# Altium schematic sheet FPGA_MODULE.SchDoc
size A4; SheetNumber: 5; SheetTotal: 8
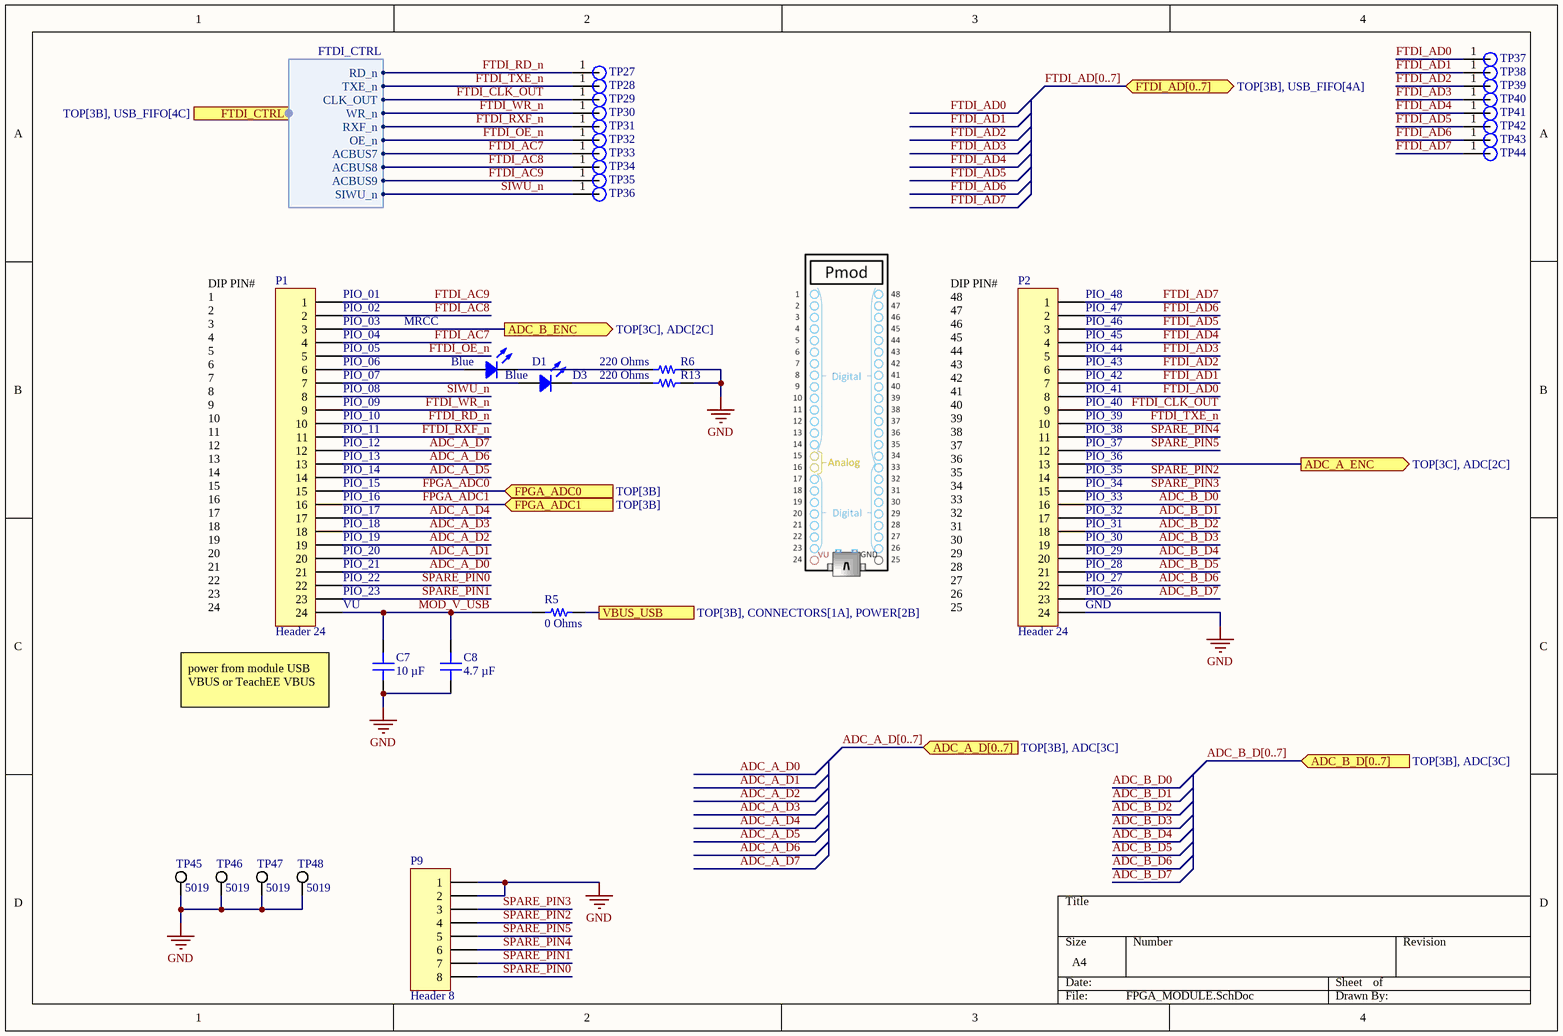
[diagram p0: FPGA_MODULE.SchDoc]

## Parts
C7  10 µF  [CAP 0805_2012]
C8  4.7 µF  [CAP 0402_1005]
D1  Blue  [LED 1206_3216 BLUE]
D3  Blue  [LED 1206_3216 BLUE]
P1  Header 24  [HDR1X24]
P2  Header 24  [HDR1X24]
P9  Header 8  [HDR1X8]
R5  0 Ohms  [RES 1206_3216]
R6  220 Ohms  [RES 0402_1005]
R13  220 Ohms  [RES 0402_1005]
TP27  Test Point  [TP1]  (value not drawn)  (no BOM)
TP28  Test Point  [TP1]  (value not drawn)  (no BOM)
TP29  Test Point  [TP1]  (value not drawn)  (no BOM)
TP30  Test Point  [TP1]  (value not drawn)  (no BOM)
TP31  Test Point  [TP1]  (value not drawn)  (no BOM)
TP32  Test Point  [TP1]  (value not drawn)  (no BOM)
TP33  Test Point  [TP1]  (value not drawn)  (no BOM)
TP34  Test Point  [TP1]  (value not drawn)  (no BOM)
TP35  Test Point  [TP1]  (value not drawn)  (no BOM)
TP36  Test Point  [TP1]  (value not drawn)  (no BOM)
TP37  Test Point  [TP1]  (value not drawn)  (no BOM)
TP38  Test Point  [TP1]  (value not drawn)  (no BOM)
TP39  Test Point  [TP1]  (value not drawn)  (no BOM)
TP40  Test Point  [TP1]  (value not drawn)  (no BOM)
TP41  Test Point  [TP1]  (value not drawn)  (no BOM)
TP42  Test Point  [TP1]  (value not drawn)  (no BOM)
TP43  Test Point  [TP1]  (value not drawn)  (no BOM)
TP44  Test Point  [TP1]  (value not drawn)  (no BOM)
TP45  5019  [KSTN-5019_V]
TP46  5019  [KSTN-5019_V]
TP47  5019  [KSTN-5019_V]
TP48  5019  [KSTN-5019_V]

## Ports
ADC_A_D[0..7] (in, see TOP[3B], ADC[3C]), ADC_A_ENC (out, see TOP[3C], ADC[2C]), ADC_B_D[0..7] (in, see TOP[3B], ADC[3C]), ADC_B_ENC (out, see TOP[3C], ADC[2C]), FPGA_ADC0 (in, see TOP[3B]), FPGA_ADC1 (in, see TOP[3B]), FTDI_AD[0..7] (bidir, see TOP[3B], USB_FIFO[4A]), FTDI_CTRL (harness FTDI_CTRL, see TOP[3B], USB_FIFO[4C]), VBUS_USB (see TOP[3B], CONNECTORS[1A], POWER[2B])

## Harnesses
FTDI_CTRL: RXF_n, TXE_n, RD_n, WR_n, CLK_OUT, OE_n, ACBUS7, ACBUS8, ACBUS9, SIWU_n

## Nets
GND: C7.1 C8.1 P2.24 P9.1 P9.2 R6.1 R13.1 TP45.1 TP46.1 TP47.1 TP48.1
ADC_A_D0: P1.21
ADC_A_D1: P1.20
ADC_A_D2: P1.19
ADC_A_D3: P1.18
ADC_A_D4: P1.17
ADC_A_D5: P1.14
ADC_A_D6: P1.13
ADC_A_D7: P1.12
ADC_A_ENC: P2.13 ; port ADC_A_ENC
ADC_B_D0: P2.16
ADC_B_D1: P2.17
ADC_B_D2: P2.18
ADC_B_D3: P2.19
ADC_B_D4: P2.20
ADC_B_D5: P2.21
ADC_B_D6: P2.22
ADC_B_D7: P2.23
ADC_B_ENC: P1.3 ; port ADC_B_ENC
FPGA_ADC0: P1.15 ; port FPGA_ADC0
FPGA_ADC1: P1.16 ; port FPGA_ADC1
FTDI_AC7: P1.4 TP33.1 ; port FTDI_CTRL.ACBUS7
FTDI_AC8: P1.2 TP34.1 ; port FTDI_CTRL.ACBUS8
FTDI_AC9: P1.1 TP35.1 ; port FTDI_CTRL.ACBUS9
FTDI_AD0: P2.8 TP37.1
FTDI_AD1: P2.7 TP38.1
FTDI_AD2: P2.6 TP39.1
FTDI_AD3: P2.5 TP40.1
FTDI_AD4: P2.4 TP41.1
FTDI_AD5: P2.3 TP42.1
FTDI_AD6: P2.2 TP43.1
FTDI_AD7: P2.1 TP44.1
FTDI_CLK_OUT: P2.9 TP29.1 ; port FTDI_CTRL.CLK_OUT
FTDI_OE_n: P1.5 TP32.1 ; port FTDI_CTRL.OE_n
FTDI_RD_n: P1.10 TP27.1 ; port FTDI_CTRL.RD_n
FTDI_RXF_n: P1.11 TP31.1 ; port FTDI_CTRL.RXF_n
FTDI_TXE_n: P2.10 TP28.1 ; port FTDI_CTRL.TXE_n
FTDI_WR_n: P1.9 TP30.1 ; port FTDI_CTRL.WR_n
MOD_V_USB: C7.2 C8.2 P1.24 R5.2
SIWU_n: P1.8 TP36.1 ; port FTDI_CTRL.SIWU_n
SPARE_PIN0: P1.22 P9.8
SPARE_PIN1: P1.23 P9.7
SPARE_PIN2: P2.14 P9.4
SPARE_PIN3: P2.15 P9.3
SPARE_PIN4: P2.11 P9.6
SPARE_PIN5: P2.12 P9.5
VBUS_USB: R5.1 ; port VBUS_USB
NetD1_1: D1.1 P1.6
NetD1_2: D1.2 R6.2
NetD3_1: D3.1 P1.7
NetD3_2: D3.2 R13.2

## Buses and harness runs
bus ADC_A_D[0..7] = port ADC_A_D[0..7]
bus ADC_B_D[0..7] = port ADC_B_D[0..7]
bus FTDI_AD[0..7] = port FTDI_AD[0..7]

## Notes on the sheet
- (near P1) PIO_01
- (near P1) PIO_02
- (near P2) PIO_47
- (near P2) PIO_48
- (near P1) PIO_03        MRCC
- (near P1) PIO_04
- (near P1) PIO_05
- (near P1) PIO_06
- (near P1) PIO_07
- (near P2) PIO_42
- (near P2) PIO_43
- (near P2) PIO_44
- (near P2) PIO_45
- (near P2) PIO_46
- (near P1) PIO_08
- (near P1) PIO_09
- (near P1) PIO_10
- (near P1) PIO_11
- (near P1) PIO_12
- (near P2) PIO_37
- (near P2) PIO_38
- (near P2) PIO_39
- (near P2) PIO_40
- (near P2) PIO_41
- (near P1) PIO_13
- (near P1) PIO_14
- (near P1) PIO_15
- (near P1) PIO_16
- (near P1) PIO_17
- (near P2) PIO_32
- (near P2) PIO_33
- (near P2) PIO_34
- (near P2) PIO_35
- (near P2) PIO_36
- (near P1) PIO_18
- (near P1) PIO_19
- (near P1) PIO_20
- (near P1) PIO_21
- (near P1) PIO_22
- (near P2) PIO_27
- (near P2) PIO_28
- (near P2) PIO_29
- (near P2) PIO_30
- (near P2) PIO_31
- DIP PIN#
  1
  2
  3
  4
  5
  6
  7
  8
  9
  10
  11
  12
  13
  14
  15
  16
  17
  18
  19
  20
  21
  22
  23
  24
- (near P1) PIO_23
- (near P1) VU
- DIP PIN#
  48
  47
  46
  45
  44
  43
  42
  41
  40
  39
  38
  37
  36
  35
  34
  33
  32
  31
  30
  29
  28
  27
  26
  25
- (near P2) PIO_26
- (near P2) GND
- power from module USB VBUS or TeachEE VBUS

## Library data of the parts
C7 = GRM21BC8YA106KE11L: CAP CER 10UF 35V X6S 0805; manufacturer: Murata Electronics; Tolerance: ±10%; Part Number: GRM21BC8YA106KE11L; Value: 10 µF; Applications: General Purpose; Capacitance: 10 µF; componentlink1description: Datasheet; componentlink1url: https://search.murata.co.jp/Ceramy/image/img/A01X/G101/ENG/GRM21BC8YA106KE11-01.pdf; componentlink2description: DigiKey Link; componentlink2url: https://www.digikey.com/en/products/detail/murata-electronics/GRM21BC8YA106KE11L/5027589; Device Package: 0805 (2012 Metric); lastupdated: 2022-07-21 4:01:21 AM; Lifecycle Status: Active; Minimum Order: 1; Mounting Type: Surface Mount, MLCC; Operating Temperature: -55°C ~ 105°C; Package / Case: 0805 (2012 Metric); packaging: TapeAndReel; partid: 16091; Part Status: Active; price: 0.11; series: GRM; Size / Dimension: 0.079" L x 0.049" W (2.00mm x 1.25mm); Supplier 1: DigiKey; Supplier Part Number 1: 490-10504-1-ND; Temperature Coefficient: X6S; Thickness (Max): 0.057" (1.45mm); Voltage - Rated: 35V
C8 = CL05A475MO5NUNC: CAP CER 4.7UF 16V X5R 0402; manufacturer: Samsung Electro-Mechanics; Tolerance: ±20%; Part Number: CL05A475MO5NUNC; Value: 4.7 µF; Applications: General Purpose; Capacitance: 4.7 µF; componentlink1description: Datasheet; componentlink1url: http://www.samsungsem.com/kr/support/product-search/mlcc/__icsFiles/afieldfile/2019/05/29/Data%20sheet_CL05A475MO5NUNC.pdf; componentlink2description: DigiKey Link; componentlink2url: https://www.digikey.com/en/products/detail/samsung-electro-mechanics/CL05A475MO5NUNC/5961320; Device Package: 0402 (1005 Metric); lastupdated: 2022-07-21 3:55:55 AM; Lifecycle Status: Active; Minimum Order: 1; Mounting Type: Surface Mount, MLCC; Operating Temperature: -55°C ~ 85°C; Package / Case: 0402 (1005 Metric); packaging: TapeAndReel; partid: 1760; Part Status: Active; price: 0.09; series: CL; Size / Dimension: 0.039" L x 0.020" W (1.00mm x 0.50mm); Supplier 1: DigiKey; Supplier Part Number 1: 1276-6836-1-ND; Temperature Coefficient: X5R; Thickness (Max): 0.028" (0.70mm); Voltage - Rated: 16V
D1 D3 = APTL3216QBC/D-01: LED SMD; Manufacturer: Kingbright; Configuration: 1206; Current - Test: 20mA; Lens Color: Colorless; Lens Size: 1.10mm Dia; Lens Style: Round with Domed Top; Lens Transparency: Clear; Millicandela Rating: 250mcd; Viewing Angle: 80°; Voltage - Forward (Vf) (Typ): 3.3V; Wavelength - Dominant: 465nm; Wavelength - Peak: 460nm; Part Number: APTL3216QBC/D-01; Color: Blue; ComponentLink1Description: Datasheet; ComponentLink1URL: http://www.kingbrightusa.com/images/catalog/SPEC/APTL3216QBC-D-01.pdf; ComponentLink2Description: DigiKey Link; ComponentLink2URL: https://www.digikey.com/en/products/detail/kingbright/APTL3216QBC-D-01/10293090; Device Package: 1206 (3216 Metric); Height (Max): 1.20mm; LastUpdated: 2022-07-15 12:08:20 PM; Lifecycle Status: Active; Minimum Order: 1; Mounting Type: Surface Mount; Package / Case: 1206 (3216 Metric); Packaging: TapeAndReel; PartId: 735; Part Status: Active; Price: 0.13; Series: Heli-R; Size / Dimension: 3.20mm L x 1.60mm W; Supplier 1: DigiKey; Supplier Part Number 1: 754-APTL3216QBC/D-01CT-ND; Supplier Device Package: 1206; Value: Blue
P1 P2 = Header 24: Header, 24-Pin; LatestRevisionDate: 17-Jul-2002; LatestRevisionNote: Re-released for DXP Platform.; Publisher: Altium Limited
P9 = Header 8: Header, 8-Pin; LatestRevisionDate: 17-Jul-2002; LatestRevisionNote: Re-released for DXP Platform.; Publisher: Altium Limited
R5 = JR1206X40E: 1206 40 AMP JUMPER; Manufacturer: Ohmite; Power (Watts): 0.32W; Part Number: JR1206X40E; ComponentLink1Description: Datasheet; ComponentLink1URL: https://www.ohmite.com/assets/docs/res_jr.pdf?r=false; ComponentLink2Description: DigiKey Link; ComponentLink2URL: https://www.digikey.com/en/products/detail/ohmite/JR1206X40E/10233373; Composition: Metal Element; Device Package: 1206 (3216 Metric); Height - Seated (Max): 0.028" (0.70mm); LastUpdated: 2022-07-25 2:10:41 AM; Lifecycle Status: Active; Minimum Order: 1; Number of Terminations: 2; Operating Temperature: -55°C ~ 150°C; Package / Case: 1206 (3216 Metric); Packaging: TapeAndReel; PartId: 30374; Part Status: Active; Price: 0.11; Resistance: 0 Ohms; Series: JR; Size / Dimension: 0.126" L x 0.063" W (3.20mm x 1.60mm); Supplier 1: DigiKey; Supplier Part Number 1: JR1206X40ECT-ND; Supplier Device Package: 1206; Tolerance: Jumper; Value: 0 Ohms
R6 R13 = CRGP0402F220R: RES 220 OHM 1% 1/8W 0402; Manufacturer: TE Connectivity Passive Product; Power (Watts): 0.125W, 1/8W; Temperature Coefficient: ±100ppm/°C; Part Number: CRGP0402F220R; Value: 220 Ohms; ComponentLink1Description: Datasheet; ComponentLink1URL: https://www.te.com/commerce/DocumentDelivery/DDEController?Action=srchrtrv&DocNm=9-1773463-9&DocType=DS&DocLang=English; ComponentLink2Description: DigiKey Link; ComponentLink2URL: https://www.digikey.com/en/products/detail/te-connectivity-passive-product/CRGP0402F220R/8576949; Composition: Thick Film; Device Package: 0402 (1005 Metric); Features: Pulse Withstanding; Height - Seated (Max): 0.016" (0.40mm); LastUpdated: 2022-07-15 11:43:01 AM; Lifecycle Status: Active; Minimum Order: 1; Number of Terminations: 2; Operating Temperature: -55°C ~ 155°C; Package / Case: 0402 (1005 Metric); Packaging: TapeAndReel; PartId: 6226; Part Status: Active; Price: 0.01; Resistance: 220 Ohms; Series: CRGP; Size / Dimension: 0.043" L x 0.020" W (1.10mm x 0.50mm); Supplier 1: DigiKey; Supplier Part Number 1: A130347CT-ND; Supplier Device Package: 0402; Tolerance: ±1%
TP27-TP44 = TP1
TP45-TP48 = CMP-1672-00008-1: Test Point, 1 Position SMD, RoHS, Tape and Reel; ComponentLink1Description: Manufacturer URL; Package Quantity: 1000; DatasheetVersion: 03/2014; Packaging: Tape and Reel; ComponentLink2URL: http://www.keyelco.com/product-pdf.cfm?p=1357; ComponentLink1URL: http://www.keyelco.com/; Mount: Surface Mount; Contact Plating: Silver; PackageDescription: 1-Pin Surface Mount Device, Body 3.81 x 2.03 mm; Pins: 1; RoHSCompliant: True; Mounting Technology: Surface Mount; ComponentLink2Description: Datasheet; PackageReference: 5019